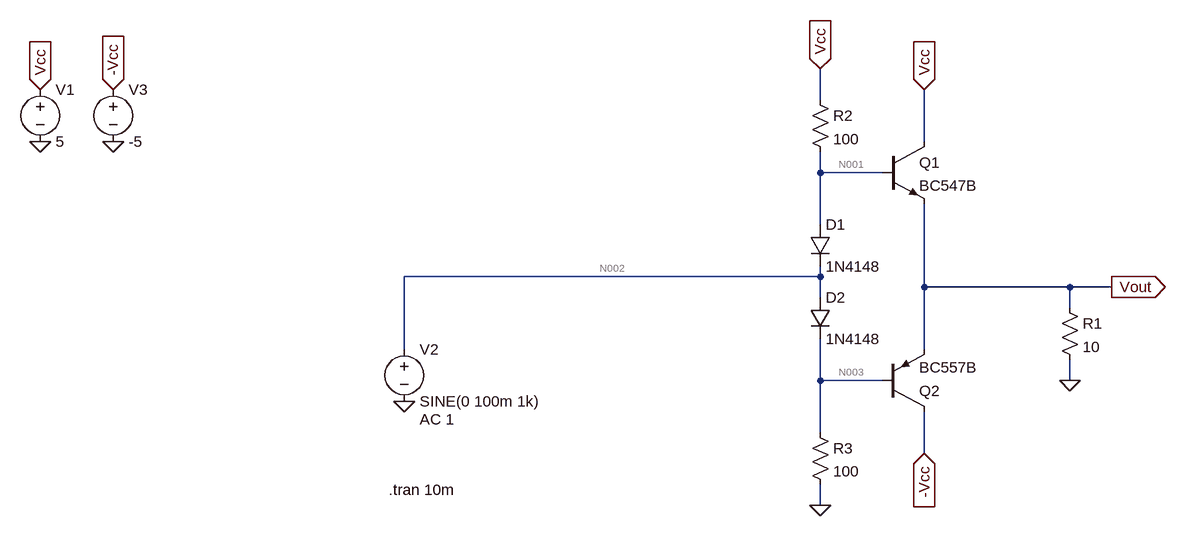
[diagram p0: schematic power_amplifier.asc]
power_amplifier.asc, the LTspice schematic file:
Version 4
SHEET 1 880 680
WIRE 48 -208 48 -256
WIRE 208 -144 208 -224
WIRE 48 -96 48 -128
WIRE 144 -96 48 -96
WIRE 48 -16 48 -96
WIRE 48 64 48 48
WIRE 48 64 -592 64
WIRE 208 80 208 -48
WIRE 432 80 208 80
WIRE 496 80 432 80
WIRE 48 96 48 64
WIRE 432 112 432 80
WIRE -592 176 -592 64
WIRE 208 176 208 80
WIRE 48 224 48 160
WIRE 144 224 48 224
WIRE 432 224 432 192
WIRE 48 304 48 224
WIRE 208 336 208 272
WIRE 48 416 48 384
FLAG -1152 -144 0
FLAG -1152 -224 Vcc
IOPIN -1152 -224 In
FLAG 496 80 Vout
IOPIN 496 80 Out
FLAG -592 256 0
FLAG -1040 -144 0
FLAG -1040 -224 -Vcc
IOPIN -1040 -224 In
FLAG 208 -224 Vcc
IOPIN 208 -224 In
FLAG 48 -256 Vcc
IOPIN 48 -256 In
FLAG 432 224 0
FLAG 48 416 0
FLAG 208 336 -Vcc
IOPIN 208 336 In
DATAFLAG 416 80 ""
SYMBOL voltage -1152 -240 R0
WINDOW 123 0 0 Left 0
WINDOW 39 0 0 Left 0
SYMATTR InstName V1
SYMATTR Value 5
SYMBOL npn 144 -144 R0
SYMATTR InstName Q1
SYMATTR Value BC547B
SYMBOL voltage -592 160 R0
WINDOW 123 24 124 Left 2
WINDOW 39 0 0 Left 0
SYMATTR Value2 AC 1
SYMATTR InstName V2
SYMATTR Value SINE(0 100m 1k)
SYMBOL pnp 144 272 M180
SYMATTR InstName Q2
SYMATTR Value BC557B
SYMBOL voltage -1040 -240 R0
WINDOW 123 0 0 Left 0
WINDOW 39 0 0 Left 0
SYMATTR InstName V3
SYMATTR Value -5
SYMBOL diode 32 -16 R0
SYMATTR InstName D1
SYMATTR Value 1N4148
SYMBOL diode 32 96 R0
SYMATTR InstName D2
SYMATTR Value 1N4148
SYMBOL res 32 -224 R0
SYMATTR InstName R2
SYMATTR Value 100
SYMBOL res 32 288 R0
SYMATTR InstName R3
SYMATTR Value 100
SYMBOL res 416 96 R0
SYMATTR InstName R1
SYMATTR Value 10
TEXT -616 392 Left 2 !.tran 10m

The netlist it stands for:
* power_amplifier.asc
V1 Vcc 0 5
Q1 Vcc N001 Vout 0 BC547B
V2 N002 0 SINE(0 100m 1k) AC 1
Q2 -Vcc N003 Vout 0 BC557B
V3 -Vcc 0 -5
D1 N001 N002 1N4148
D2 N002 N003 1N4148
R2 Vcc N001 100
R3 N003 0 100
R1 Vout 0 10
.model D D
.lib standard.dio
.model NPN NPN
.model PNP PNP
.lib standard.bjt
.tran 10m
.backanno
.end

* Results of the author's LTspice run, read from the files saved beside the schematic
* Operating Point, zero values left out:
*   V(vcc) = 5 V
*   V(n001) = 777.7 mV
*   V(vout) = 81.27 mV
*   V(-vcc) = -5 V
*   Ic(Q1) = 8.099 mA
*   Ib(Q1) = 28.11 µA
*   Ie(Q1) = -8.127 mA
*   Ic(Q2) = -6.354 pA
*   Ib(Q2) = 5.121 pA
*   Ie(Q2) = 1.235 pA
*   I(D1) = 42.19 mA
*   I(R2) = 42.22 mA
*   I(R3) = -5.121 pA
*   I(R1) = 8.127 mA
*   I(V1) = -50.32 mA
*   I(V2) = 42.19 mA
*   I(V3) = 6.354 pA
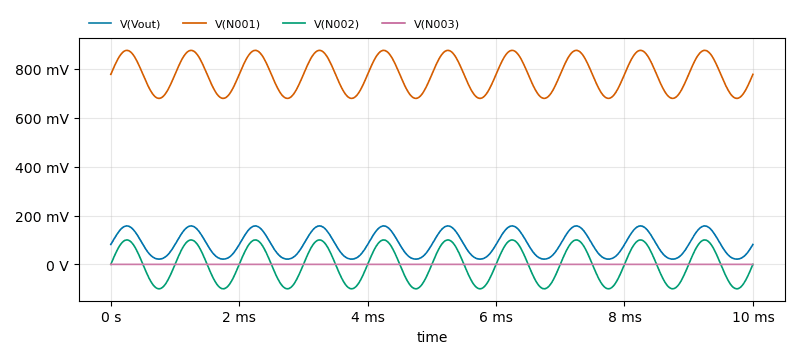
[diagram p1: Transient Analysis of power_amplifier.asc, plotted from the saved traces]
* Transient Analysis, 1 run:
*   V(Vout): min 21.56 mV, max 157.3 mV, average 85.23 mV, rms 98.14 mV, last 81.27 mV
*   V(N001): min 679.5 mV, max 876 mV, average 777.7 mV, rms 780.8 mV, last 777.7 mV
*   V(N002): min -100 mV, max 100 mV, average -23.97 µV, rms 70.74 mV, last 0 V
*   V(N003): min -869.5 nV, max 2.123 µV, average 413.4 nV, rms 1.044 µV, last 829 nV